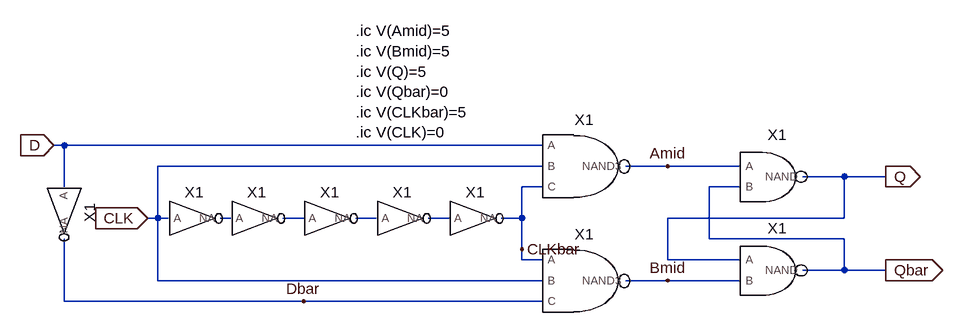
[diagram p0: schematic DFF1.asc]
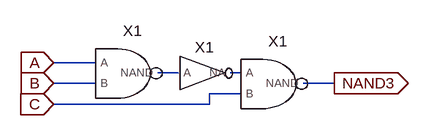
[diagram p1: sub-circuit nand3.asc]
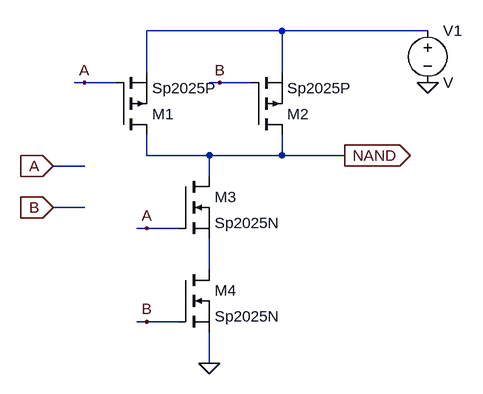
[diagram p2: sub-circuit nand.asc]
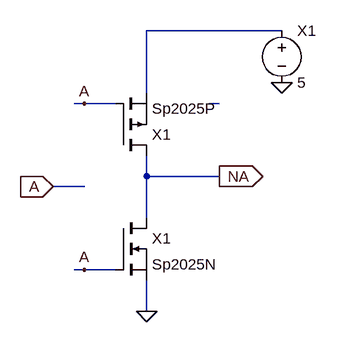
[diagram p3: sub-circuit invert.asc]
DFF1.asc, the LTspice schematic file:
Version 4
SHEET 1 880 680
WIRE -592 64 -608 64
WIRE 144 64 -592 64
WIRE 144 96 -448 96
WIRE 336 96 272 96
WIRE 448 96 336 96
WIRE 608 112 544 112
WIRE 672 112 608 112
WIRE -592 128 -592 64
WIRE 144 128 112 128
WIRE 448 128 400 128
WIRE -448 176 -448 96
WIRE -448 176 -464 176
WIRE -432 176 -448 176
WIRE -336 176 -352 176
WIRE -224 176 -256 176
WIRE -112 176 -144 176
WIRE 0 176 -32 176
WIRE 112 176 112 128
WIRE 112 176 80 176
WIRE 608 176 608 112
WIRE 608 176 336 176
WIRE 400 208 400 128
WIRE 608 208 400 208
WIRE 112 224 112 176
WIRE 112 240 112 224
WIRE 144 240 112 240
WIRE 336 240 336 176
WIRE 448 240 336 240
WIRE 608 256 608 208
WIRE 608 256 544 256
WIRE 672 256 608 256
WIRE -448 272 -448 176
WIRE 144 272 -448 272
WIRE 336 272 272 272
WIRE 448 272 336 272
WIRE -592 304 -592 208
WIRE -224 304 -592 304
WIRE 144 304 -224 304
FLAG -608 64 D
IOPIN -608 64 In
FLAG -464 176 CLK
IOPIN -464 176 In
FLAG 672 112 Q
IOPIN 672 112 Out
FLAG 672 256 Qbar
IOPIN 672 256 Out
FLAG -224 304 Dbar
FLAG 336 96 Amid
FLAG 336 272 Bmid
FLAG 112 224 CLKbar
SYMBOL NAND3 208 96 R0
SYMATTR InstName X1
SYMBOL NAND3 208 272 R0
SYMATTR InstName X1
SYMBOL INVERT 32 176 R0
SYMATTR InstName X1
SYMBOL INVERT -80 176 R0
SYMATTR InstName X1
SYMBOL INVERT -192 176 R0
SYMATTR InstName X1
SYMBOL INVERT -304 176 R0
SYMATTR InstName X1
SYMBOL INVERT -400 176 R0
SYMATTR InstName X1
SYMBOL NAND 496 112 R0
SYMATTR InstName X1
SYMBOL NAND 496 256 R0
SYMATTR InstName X1
SYMBOL INVERT -592 160 R90
SYMATTR InstName X1
TEXT -144 -112 Left 2 !.ic V(Amid)=5\n.ic V(Bmid)=5\n.ic V(Q)=5\n.ic V(Qbar)=0\n.ic V(CLKbar)=5\n.ic V(CLK)=0

nand3.asc, the sub-circuit schematic file:
Version 4
SHEET 1 880 680
WIRE 80 80 16 80
WIRE 208 96 176 96
WIRE 304 96 288 96
WIRE 80 112 16 112
WIRE 448 112 400 112
WIRE 304 128 256 128
WIRE 256 144 256 128
WIRE 256 144 16 144
FLAG 16 80 A
IOPIN 16 80 In
FLAG 16 112 B
IOPIN 16 112 In
FLAG 16 144 C
IOPIN 16 144 In
FLAG 448 112 NAND3
IOPIN 448 112 Out
SYMBOL NAND 128 96 R0
SYMATTR InstName X1
SYMBOL NAND 352 112 R0
SYMATTR InstName X1
SYMBOL INVERT 240 96 R0
SYMATTR InstName X1

nand.asc, the sub-circuit schematic file:
Version 4
SHEET 1 880 680
.lib SHEET 1 880 680
WIRE 336 -160 128 -160
WIRE 560 -160 336 -160
WIRE 128 -96 128 -160
WIRE 336 -96 336 -160
WIRE 32 -80 16 -80
WIRE 80 -80 32 -80
WIRE 240 -80 224 -80
WIRE 288 -80 240 -80
WIRE 128 32 128 0
WIRE 224 32 128 32
WIRE 336 32 336 0
WIRE 336 32 224 32
WIRE 432 32 336 32
WIRE 32 48 -16 48
WIRE 224 64 224 32
WIRE 32 112 -16 112
WIRE 128 144 112 144
WIRE 176 144 128 144
WIRE 224 208 224 160
WIRE 128 288 112 288
WIRE 176 288 128 288
WIRE 224 352 224 304
FLAG 224 352 0
FLAG -16 48 A
IOPIN -16 48 In
FLAG -16 112 B
IOPIN -16 112 In
FLAG 128 144 A
FLAG 128 288 B
FLAG 32 -80 A
FLAG 240 -80 B
FLAG 432 32 NAND
IOPIN 432 32 Out
FLAG 560 -80 0
SYMBOL pmos 80 0 M180
SYMATTR InstName M1
SYMATTR Value Sp2025P
SYMBOL pmos 288 0 M180
SYMATTR InstName M2
SYMATTR Value Sp2025P
SYMBOL nmos 176 64 R0
SYMATTR InstName M3
SYMATTR Value Sp2025N
SYMBOL nmos 176 208 R0
SYMATTR InstName M4
SYMATTR Value Sp2025N
SYMBOL voltage 560 -176 R0
SYMATTR InstName V1

invert.asc, the sub-circuit schematic file:
Version 4
SHEET 1 880 680
WIRE 352 -80 144 -80
WIRE 144 16 144 -80
WIRE 48 32 32 32
WIRE 96 32 48 32
WIRE 256 32 240 32
WIRE 144 144 144 112
WIRE 256 144 144 144
WIRE 48 160 0 160
WIRE 144 208 144 144
WIRE 48 288 32 288
WIRE 96 288 48 288
WIRE 144 352 144 304
FLAG 144 352 0
FLAG 0 160 A
IOPIN 0 160 In
FLAG 48 288 A
FLAG 48 32 A
FLAG 256 144 NA
IOPIN 256 144 Out
FLAG 352 0 0
SYMBOL pmos 96 112 M180
SYMATTR InstName X1
SYMATTR Value Sp2025P
SYMBOL nmos 96 208 R0
SYMATTR InstName X1
SYMATTR Value Sp2025N
SYMBOL voltage 352 -96 R0
SYMATTR InstName X1
SYMATTR Value 5

The netlist it stands for:
* DFF1.asc
XX1 D CLK CLKbar Amid nand3
XX1 CLKbar CLK Dbar Bmid nand3
XX1 N004 CLKbar invert
XX1 N003 N004 invert
XX1 N002 N003 invert
XX1 N001 N002 invert
XX1 CLK N001 invert
XX1 Amid Qbar Q nand
XX1 Q Bmid Qbar nand
XX1 D Dbar invert

* block symbol definitions
.subckt nand3 A B C NAND3
XX1 A B N001 nand
XX1 N002 C NAND3 nand
XX1 N001 N002 invert
.ends nand3

.subckt nand A B NAND
M1 NAND A N001 N001 Sp2025P
M2 NAND B N001 N001 Sp2025P
M3 NAND A N002 N002 Sp2025N
M4 N002 B 0 0 Sp2025N
V1 N001 0 V
.ends nand

.subckt invert A NA
M§X1 NA A N001 N001 Sp2025P
M§X1 NA A 0 0 Sp2025N
V§X1 N001 0 5
.ends invert

.model NMOS NMOS
.model PMOS PMOS
.lib standard.mos
.ic V(Amid)=5
.ic V(Bmid)=5
.ic V(Q)=5
.ic V(Qbar)=0
.ic V(CLKbar)=5
.ic V(CLK)=0
.backanno
.end